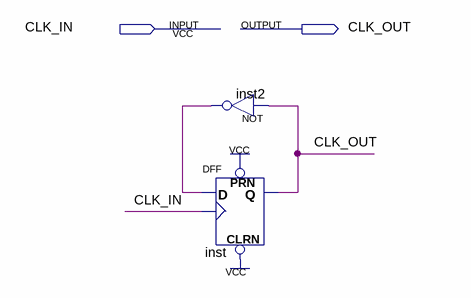
[diagram p0: schematic sheet]
// Quartus schematic CLK_DIV_UNIT.bdf as structural Verilog: 2 symbols, 2 pins
module CLK_DIV_UNIT (
  input  CLK_IN,
  output CLK_OUT
);

  wire inst2_out;

  not inst2 (inst2_out, CLK_OUT);
  DFF inst (.CLRN(1'b1), .CLK(CLK_IN), .D(inst2_out), .PRN(1'b1), .Q(CLK_OUT));
endmodule
